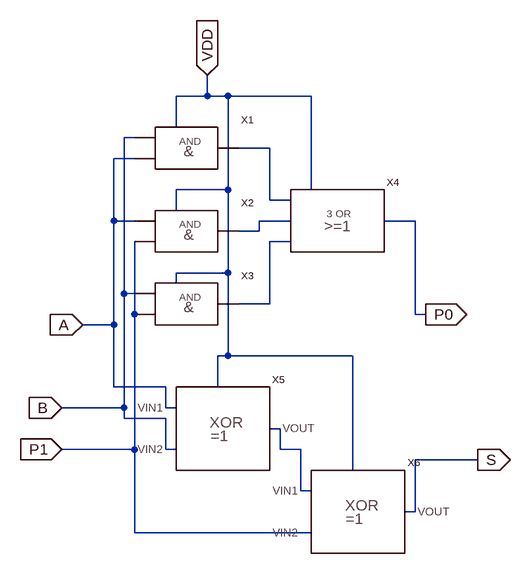
[diagram p0: schematic adder1.asc]
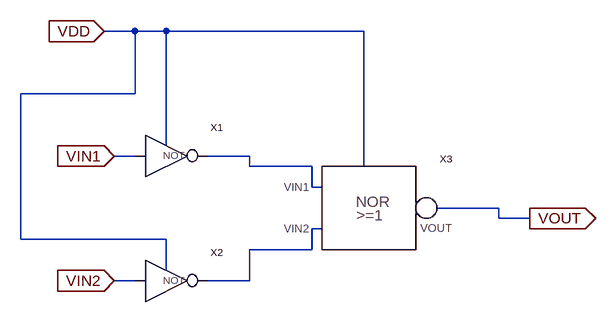
[diagram p1: sub-circuit and.asc]
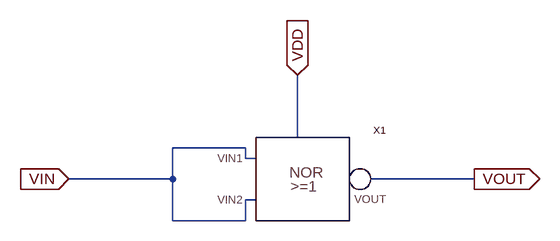
[diagram p2: sub-circuit not.asc]
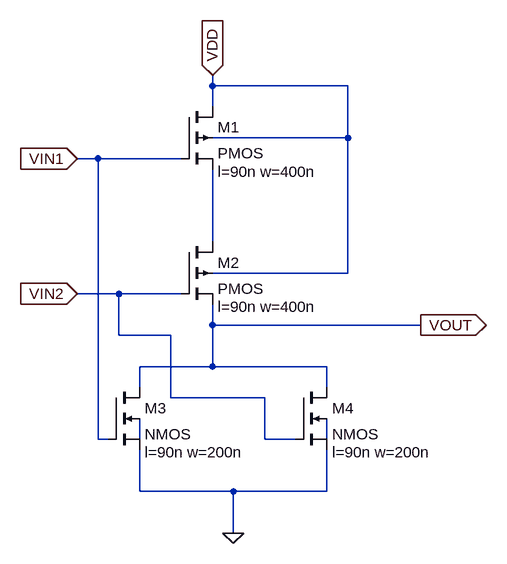
[diagram p3: sub-circuit nor.asc]
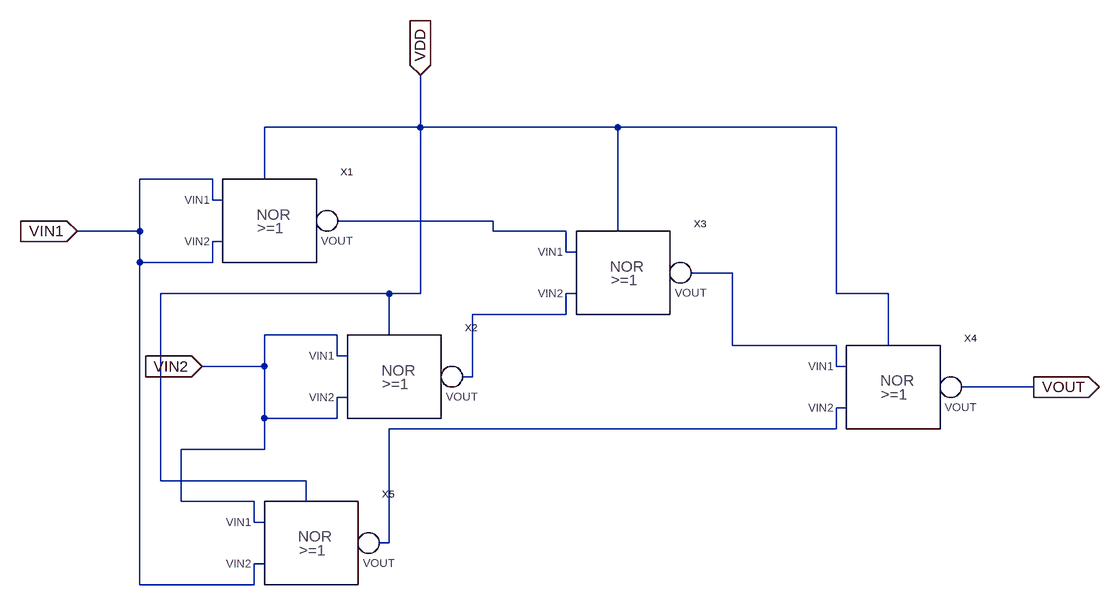
[diagram p4: sub-circuit xor.asc]
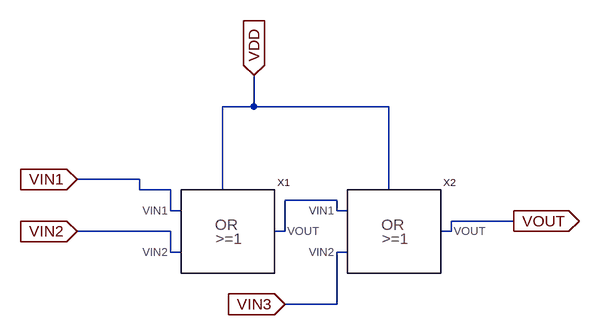
[diagram p5: sub-circuit triple_or.asc]
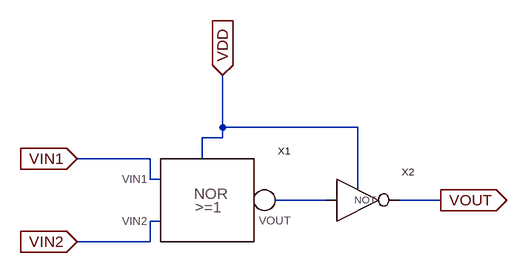
[diagram p6: sub-circuit or.asc]
adder1.asc, the LTspice schematic file:
Version 4
SHEET 1 880 680
WIRE 160 -80 160 -112
WIRE 160 -80 112 -80
WIRE 192 -80 160 -80
WIRE 320 -80 192 -80
WIRE 112 -32 112 -80
WIRE 80 -16 32 -16
WIRE 256 0 176 0
WIRE 80 16 16 16
WIRE 192 64 192 -80
WIRE 192 64 112 64
WIRE 320 64 320 -80
WIRE 256 80 256 0
WIRE 288 80 256 80
WIRE 112 96 112 64
WIRE 16 112 16 16
WIRE 80 112 16 112
WIRE 288 112 240 112
WIRE 480 112 432 112
WIRE 240 128 240 112
WIRE 240 128 176 128
WIRE 80 144 48 144
WIRE 288 144 256 144
WIRE 192 192 192 64
WIRE 192 192 112 192
WIRE 112 208 112 192
WIRE 32 224 32 -16
WIRE 80 224 32 224
WIRE 256 240 256 144
WIRE 256 240 176 240
WIRE 48 256 48 144
WIRE 80 256 48 256
WIRE 480 256 480 112
WIRE 496 256 480 256
WIRE 16 272 16 112
WIRE 16 272 -32 272
WIRE 192 320 192 192
WIRE 192 320 176 320
WIRE 384 320 192 320
WIRE 16 368 16 272
WIRE 96 368 16 368
WIRE 176 368 176 320
WIRE 32 400 32 224
WIRE 32 400 -64 400
WIRE 96 400 96 368
WIRE 112 400 96 400
WIRE 32 416 32 400
WIRE 96 416 32 416
WIRE 272 432 256 432
WIRE 48 464 48 256
WIRE 48 464 -64 464
WIRE 96 464 96 416
WIRE 112 464 96 464
WIRE 272 464 272 432
WIRE 304 464 272 464
WIRE 576 480 480 480
WIRE 384 496 384 320
WIRE 304 528 304 464
WIRE 320 528 304 528
WIRE 480 560 480 480
WIRE 480 560 464 560
WIRE 48 592 48 464
WIRE 320 592 48 592
FLAG -64 464 P1
IOPIN -64 464 In
FLAG -32 272 A
IOPIN -32 272 In
FLAG 160 -112 VDD
IOPIN 160 -112 In
FLAG 576 480 S
IOPIN 576 480 Out
FLAG 496 256 P0
IOPIN 496 256 Out
FLAG -64 400 B
IOPIN -64 400 In
SYMBOL and 80 0 R0
SYMATTR InstName X1
SYMBOL and 80 128 R0
SYMATTR InstName X2
SYMBOL and 80 240 R0
SYMATTR InstName X3
SYMBOL xor 96 400 R0
SYMATTR InstName X5
SYMBOL xor 304 528 R0
SYMATTR InstName X6
SYMBOL triple_or 288 112 R0
SYMATTR InstName X4

and.asc, the sub-circuit schematic file:
Version 4
SHEET 1 880 680
WIRE 64 -96 16 -96
WIRE 112 -96 64 -96
WIRE 416 -96 112 -96
WIRE 64 0 64 -96
WIRE 64 0 -112 0
WIRE 112 80 112 -96
WIRE 80 96 32 96
WIRE 240 96 160 96
WIRE 240 112 240 96
WIRE 336 112 240 112
WIRE 416 112 416 -96
WIRE 336 144 336 112
WIRE 352 144 336 144
WIRE 624 176 528 176
WIRE 624 192 624 176
WIRE 672 192 624 192
WIRE 352 208 336 208
WIRE -112 224 -112 0
WIRE 112 224 -112 224
WIRE 336 240 336 208
WIRE 336 240 240 240
WIRE 112 272 112 224
WIRE 80 288 32 288
WIRE 240 288 240 240
WIRE 240 288 160 288
FLAG 32 96 VIN1
IOPIN 32 96 In
FLAG 32 288 VIN2
IOPIN 32 288 In
FLAG 672 192 VOUT
IOPIN 672 192 Out
FLAG 16 -96 VDD
IOPIN 16 -96 In
SYMBOL not 96 96 R0
SYMATTR InstName X1
SYMBOL not 96 288 R0
SYMATTR InstName X2
SYMBOL nor 336 144 R0
SYMATTR InstName X3

not.asc, the sub-circuit schematic file:
Version 4
SHEET 1 880 680
WIRE 384 80 384 -16
WIRE 304 96 192 96
WIRE 304 112 304 96
WIRE 320 112 304 112
WIRE 192 144 192 96
WIRE 192 144 32 144
WIRE 656 144 496 144
WIRE 320 176 304 176
WIRE 192 208 192 144
WIRE 304 208 304 176
WIRE 304 208 192 208
FLAG 32 144 VIN
IOPIN 32 144 In
FLAG 384 -16 VDD
IOPIN 384 -16 In
FLAG 656 144 VOUT
IOPIN 656 144 Out
SYMBOL nor 304 112 R0
SYMATTR InstName X1

nor.asc, the sub-circuit schematic file:
Version 4
SHEET 1 880 680
WIRE -32 -64 -32 -80
WIRE 176 -64 -32 -64
WIRE -32 -32 -32 -64
WIRE 176 16 176 -64
WIRE 176 16 -32 16
WIRE -208 48 -240 48
WIRE -80 48 -208 48
WIRE -32 176 -32 64
WIRE 176 224 176 16
WIRE 176 224 -32 224
WIRE -176 256 -240 256
WIRE -80 256 -176 256
WIRE -32 304 -32 272
WIRE 288 304 -32 304
WIRE -176 320 -176 256
WIRE -96 320 -176 320
WIRE -32 368 -32 304
WIRE -32 368 -144 368
WIRE 144 368 -32 368
WIRE -144 400 -144 368
WIRE 144 400 144 368
WIRE -96 416 -96 320
WIRE 48 416 -96 416
WIRE -208 480 -208 48
WIRE -192 480 -208 480
WIRE -144 480 -144 448
WIRE 48 480 48 416
WIRE 96 480 48 480
WIRE 144 480 144 448
WIRE -144 560 -144 496
WIRE 0 560 -144 560
WIRE 144 560 144 496
WIRE 144 560 0 560
WIRE 0 624 0 560
FLAG -32 -80 VDD
IOPIN -32 -80 In
FLAG -240 48 VIN1
IOPIN -240 48 In
FLAG -240 256 VIN2
IOPIN -240 256 In
FLAG 288 304 VOUT
IOPIN 288 304 Out
FLAG 0 624 0
SYMBOL pmos4 -80 -32 R0
WINDOW 123 56 100 Left 2
SYMATTR Value2 l=90n w=400n
SYMATTR InstName M1
SYMBOL pmos4 -80 176 R0
WINDOW 123 56 100 Left 2
SYMATTR Value2 l=90n w=400n
SYMATTR InstName M2
SYMBOL nmos4 -192 400 R0
WINDOW 123 56 100 Left 2
SYMATTR Value2 l=90n w=200n
SYMATTR InstName M3
SYMBOL nmos4 96 400 R0
WINDOW 123 56 100 Left 2
SYMATTR Value2 l=90n w=200n
SYMATTR InstName M4

xor.asc, the sub-circuit schematic file:
Version 4
SHEET 1 1624 716
WIRE 592 -32 592 -112
WIRE 592 -32 352 -32
WIRE 896 -32 592 -32
WIRE 1232 -32 896 -32
WIRE 272 48 160 48
WIRE 352 48 352 -32
WIRE 272 80 272 48
WIRE 288 80 272 80
WIRE 704 112 464 112
WIRE 160 128 160 48
WIRE 160 128 64 128
WIRE 704 128 704 112
WIRE 816 128 704 128
WIRE 896 128 896 -32
WIRE 288 144 272 144
WIRE 816 160 816 128
WIRE 832 160 816 160
WIRE 160 176 160 128
WIRE 272 176 272 144
WIRE 272 176 160 176
WIRE 1072 192 1008 192
WIRE 544 224 192 224
WIRE 592 224 592 -32
WIRE 592 224 544 224
WIRE 832 224 816 224
WIRE 1232 224 1232 -32
WIRE 1312 224 1232 224
WIRE 816 256 816 224
WIRE 816 256 672 256
WIRE 464 288 352 288
WIRE 544 288 544 224
WIRE 1072 304 1072 192
WIRE 1232 304 1072 304
WIRE 1312 304 1312 224
WIRE 464 320 464 288
WIRE 480 320 464 320
WIRE 352 336 352 288
WIRE 352 336 256 336
WIRE 1232 336 1232 304
WIRE 1248 336 1232 336
WIRE 672 352 672 256
WIRE 672 352 656 352
WIRE 1536 368 1424 368
WIRE 480 384 464 384
WIRE 1248 400 1232 400
WIRE 352 416 352 336
WIRE 464 416 464 384
WIRE 464 416 352 416
WIRE 1232 432 1232 400
WIRE 1232 432 544 432
WIRE 352 464 352 416
WIRE 352 464 224 464
WIRE 192 512 192 224
WIRE 416 512 192 512
WIRE 224 544 224 464
WIRE 336 544 224 544
WIRE 416 544 416 512
WIRE 336 576 336 544
WIRE 352 576 336 576
WIRE 544 608 544 432
WIRE 544 608 528 608
WIRE 352 640 336 640
WIRE 160 672 160 176
WIRE 336 672 336 640
WIRE 336 672 160 672
FLAG 64 128 VIN1
IOPIN 64 128 In
FLAG 256 336 VIN2
IOPIN 256 336 In
FLAG 1536 368 VOUT
IOPIN 1536 368 Out
FLAG 592 -112 VDD
IOPIN 592 -112 In
SYMBOL nor 272 80 R0
SYMATTR InstName X1
SYMBOL nor 464 320 R0
SYMATTR InstName X2
SYMBOL nor 816 160 R0
SYMATTR InstName X3
SYMBOL nor 1232 336 R0
SYMATTR InstName X4
SYMBOL nor 336 576 R0
SYMATTR InstName X5

triple_or.asc, the sub-circuit schematic file:
Version 4
SHEET 1 936 680
WIRE 448 16 448 -32
WIRE 448 16 400 16
WIRE 656 16 448 16
WIRE 272 128 176 128
WIRE 272 144 272 128
WIRE 320 144 272 144
WIRE 400 144 400 16
WIRE 656 144 656 16
WIRE 576 160 496 160
WIRE 320 176 320 144
WIRE 336 176 320 176
WIRE 576 176 576 160
WIRE 592 176 576 176
WIRE 848 192 752 192
WIRE 320 208 176 208
WIRE 496 208 496 160
WIRE 496 208 480 208
WIRE 752 208 752 192
WIRE 752 208 736 208
WIRE 320 240 320 208
WIRE 336 240 320 240
WIRE 592 240 576 240
WIRE 576 320 576 240
WIRE 576 320 496 320
FLAG 176 128 VIN1
IOPIN 176 128 In
FLAG 176 208 VIN2
IOPIN 176 208 In
FLAG 496 320 VIN3
IOPIN 496 320 In
FLAG 848 192 VOUT
IOPIN 848 192 Out
FLAG 448 -32 VDD
IOPIN 448 -32 In
SYMBOL or 320 176 R0
SYMATTR InstName X1
SYMBOL or 576 176 R0
SYMATTR InstName X2

or.asc, the sub-circuit schematic file:
Version 4
SHEET 1 880 680
WIRE 288 80 288 0
WIRE 496 80 288 80
WIRE 288 96 288 80
WIRE 288 96 256 96
WIRE 176 128 64 128
WIRE 256 128 256 96
WIRE 176 160 176 128
WIRE 192 160 176 160
WIRE 496 176 496 80
WIRE 464 192 368 192
WIRE 624 192 544 192
WIRE 192 224 176 224
WIRE 176 256 176 224
WIRE 176 256 64 256
FLAG 64 128 VIN1
IOPIN 64 128 In
FLAG 64 256 VIN2
IOPIN 64 256 In
FLAG 624 192 VOUT
IOPIN 624 192 Out
FLAG 288 0 VDD
IOPIN 288 0 In
SYMBOL nor 176 160 R0
SYMATTR InstName X1
SYMBOL not 480 192 R0
SYMATTR InstName X2

The netlist it stands for:
* adder1.asc
XX1 B A N001 VDD and
XX2 A P1 N002 VDD and
XX3 B P1 N003 VDD and
XX5 A B N004 VDD xor
XX6 N004 P1 S VDD xor
XX4 N001 N002 N003 P0 VDD triple_or

* block symbol definitions
.subckt and VIN1 VIN2 VOUT VDD
XX1 VIN1 N001 VDD not
XX2 VIN2 N002 VDD not
XX3 N001 N002 VOUT VDD nor
.ends and

.subckt not VIN VOUT VDD
XX1 VIN VIN VOUT VDD nor
.ends not

.subckt nor VIN1 VIN2 VOUT VDD
M1 VDD VIN1 N001 VDD PMOS l=90n w=400n
M2 N001 VIN2 VOUT VDD PMOS l=90n w=400n
M3 VOUT VIN1 0 N002 NMOS l=90n w=200n
M4 VOUT VIN2 0 N003 NMOS l=90n w=200n
.ends nor

.subckt xor VIN1 VIN2 VOUT VDD
XX1 VIN1 VIN1 N001 VDD nor
XX2 VIN2 VIN2 N003 VDD nor
XX3 N001 N003 N002 VDD nor
XX4 N002 N004 VOUT VDD nor
XX5 VIN2 VIN1 N004 VDD nor
.ends xor

.subckt triple_or VIN1 VIN2 VIN3 VOUT VDD
XX1 VIN1 VIN2 N001 VDD or
XX2 N001 VIN3 VOUT VDD or
.ends triple_or

.subckt or VIN1 VIN2 VOUT VDD
XX1 VIN1 VIN2 N001 VDD nor
XX2 N001 VOUT VDD not
.ends or

.model NMOS NMOS
.model PMOS PMOS
.lib standard.mos
.backanno
.end